# EAGLE design USBHopper (EAGLE 6.5.0)
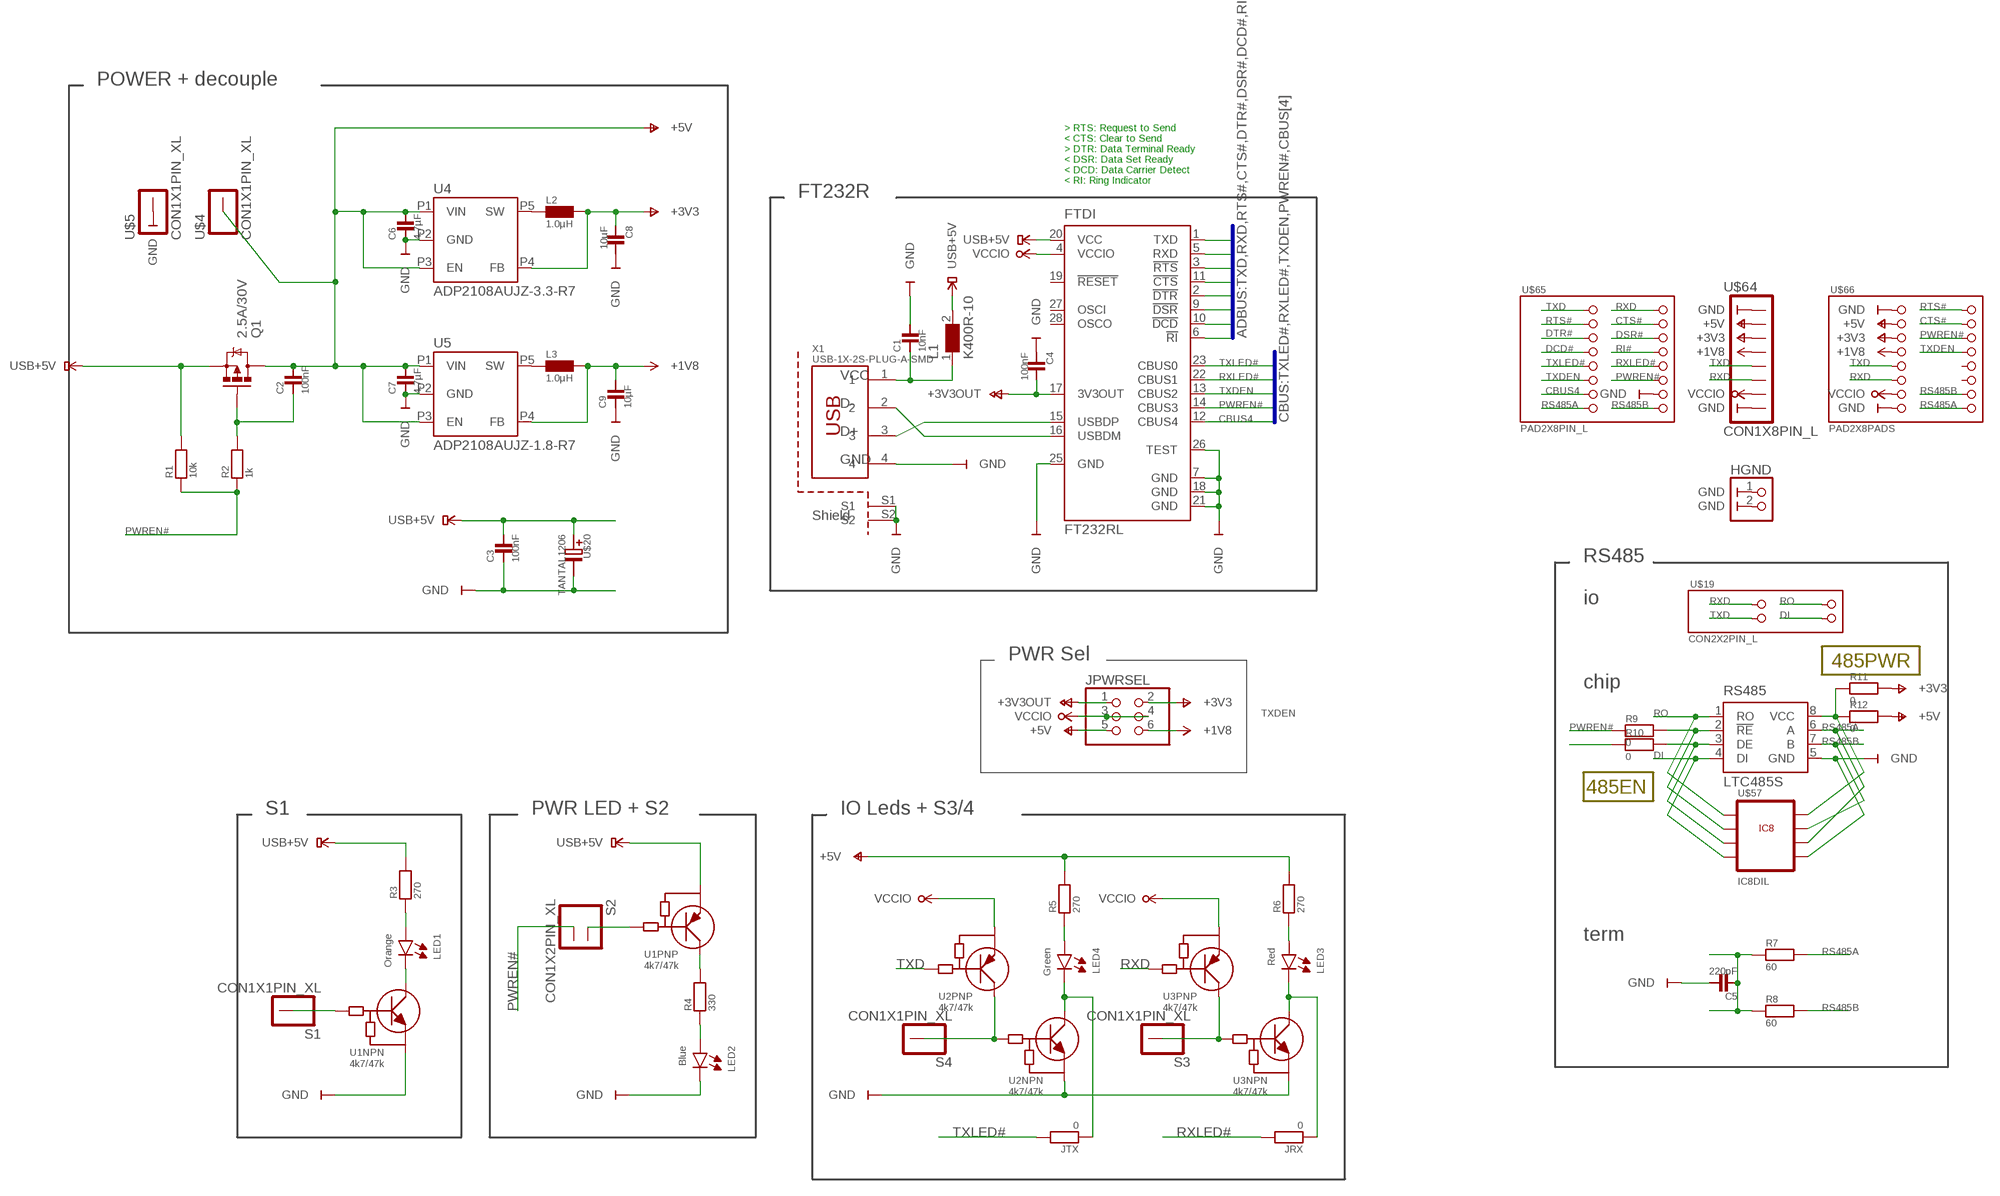
[diagram p0: schematic, sheet 1]

## Parts
C1  10nF  CAPACITOR  [0805]
C2  100nF  CAPACITOR  [0805]
C3  100nF  CAPACITOR  [0805]
C4  100nF  CAPACITOR  [0805]
C5  220pF  CAPACITOR  [0805]
C6  4.7µF  CAPACITOR  [0805]
C7  4.7µF  CAPACITOR  [0805]
C8  10µF  CAPACITOR  [0805]
C9  10µF  CAPACITOR  [0805]
FTDI  FT232RL  [SSOP28_FLO]
HGND  PINHD-1X2  [1X02]
JPWRSEL  PINHD-2X3  [2X03]
JRX  0  RESISTORCONNECT  [0805_CONNECT]
JTX  0  RESISTORCONNECT  [0805_CONNECT]
L1  K400R-10  WE-CBF_0805  [0805]
L2  1.0µH  INDUCTOR  [0806]
L3  1.0µH  INDUCTOR  [0806]
LED1  Orange  LEDKPT-2012-E  [KPT-2012-E]
LED2  Blue  LEDKPT-2012-E  [KPT-2012-E]
LED3  Red  LEDKPT-2012-E  [KPT-2012-E]
LED4  Green  LEDKPT-2012-E  [KPT-2012-E]
Q1  2.5A/30V  MOSFET-PCHANNELDMG2307L  [SOT23-3]
R1  10k  RESISTORWIDE  [0805]
R2  1k  RESISTORWIDE  [0805]
R3  270  RESISTORWIDE  [0805]
R4  330  RESISTORWIDE  [0805]
R5  270  RESISTORWIDE  [0805]
R6  270  RESISTORWIDE  [0805]
R7  60  RESISTORWIDE  [0805]
R8  60  RESISTORCONNECT  [0805_CONNECT]
R9  0  RESISTORCONNECT  [0805_CONNECT]
R10  0  RESISTORCONNECT  [0805_CONNECT]
R11  0  RESISTORCONNECT  [0805_CONNECT]
R12  0  RESISTORCONNECT  [0805_CONNECT]
RS485  LTC485S  [SOIC8]
S1  CON1X1PIN_XL  [1X1PINS]
S2  CON1X2PIN_XL  [1X2PINS]
S3  CON1X1PIN_XL  [1X1PINS]
S4  CON1X1PIN_XL  [1X1PINS]
U1  4k7/47k  PNP_NPN_BIASNXP_PIMD3  [SOT-457]
U2  4k7/47k  PNP_NPN_BIASNXP_PIMD3  [SOT-457]
U3  4k7/47k  PNP_NPN_BIASNXP_PIMD3  [SOT-457]
U4  ADP2108AUJZ-3.3-R7  DCDC  [SOT23]
U5  ADP2108AUJZ-1.8-R7  DCDC  [SOT23]
U$4  CON1X1PIN_XL  [1X1PINS]
U$5  CON1X1PIN_XL  [1X1PINS]
U$19  CON2X2PIN_L  [2X2PINS_L]
U$20  TANTAL1206  [1206]
U$57  IC8DIL  [DIL8]
U$64  CON1X8PIN_L  [1X8PINS_L]
U$65  PAD2X8PIN_L  [2X8PINS_L]
U$66  PAD2X8PADS  [2X8PADS]
X1  USB-1X-2S-PLUG-A-SMD  [USB-PLUG-A-SMD-2S]

## Nets
+1V8: C9.P$2 JPWRSEL.6 L3.P$1 U5.P4(FB) U$64.P$4 U$66.P$7
+3V3: C8.P$1 JPWRSEL.2 L2.P$1 R11.P$2 U4.P4(FB) U$64.P$3 U$66.P$5
+3V3OUT: C4.P$2 FTDI.17(3V3OUT) JPWRSEL.1
+5V: C2.P$2 C6.P$2 C7.P$2 JPWRSEL.5 Q1.3(D) R5.P$2 R6.P$2 R12.P$2 U4.P1(VIN) U4.P3(EN) U5.P1(VIN) U5.P3(EN) U$4.P$1 U$64.P$2 U$66.P$3
CBUS4: FTDI.12(CBUS4) U$65.P$13
CTS#: FTDI.11(!CTS) U$65.P$4 U$66.P$4
DCD#: FTDI.10(!DCD) U$65.P$7
DE: R10.P$2 RS485.3(DE) U$57.P$3
DI: RS485.4(DI) U$19.P$4 U$57.P$4
DSR#: FTDI.9(!DSR) U$65.P$6
DTR#: FTDI.2(!DTR) U$65.P$5
GND: C1.P$2 C3.P$1 C4.P$1 C5.P$2 C6.P$1 C7.P$1 C8.P$2 C9.P$1 FTDI.7(GND) FTDI.18(GND) FTDI.21(GND) FTDI.25(GND) FTDI.26(TEST) HGND.1 HGND.2 LED2.2(C$1) RS485.5(GND) U1.P$1(NPN:E) U2.P$1(NPN:E) U3.P$1(NPN:E) U4.P2(GND) U5.P2(GND) U$5.P$1 U$20.P$2 U$57.P$5 U$64.P$1 U$64.P$8 U$65.P$14 U$66.P$1 U$66.P$15 X1.4 X1.S1 X1.S2
N$1: LED2.1(A$1) R4.P$1
N$2: LED1.1(A$1) R3.P$1
N$4: C1.P$1 L1.1 X1.1
N$5: L2.P$2 U4.P5(SW)
N$6: JRX.P$1 LED3.2(C$1) U3.P$6(NPN:C)
N$7: L3.P$2 U5.P5(SW)
N$8: C5.P$1 R7.P$1 R8.P$1
N$9: R11.P$1 R12.P$1 RS485.8(VCC) U$57.P$8
N$10: JTX.P$1 LED4.2(C$1) U2.P$6(NPN:C)
N$11: LED4.1(A$1) R5.P$1
N$12: LED3.1(A$1) R6.P$1
N$13: R4.P$2 U1.P$3(PNP:C)
N$14: S2.P$1 U1.P$5(PNP:B)
N$15: LED1.2(C$1) U1.P$6(NPN:C)
PWREN: C2.P$1 Q1.1(G) R2.P$2
PWREN#: FTDI.14(CBUS3) R1.P$1 R2.P$1 R9.P$1 S2.P$2 U$65.P$12 U$66.P$6
RE#: R9.P$2 RS485.2(!RE) U$57.P$2
RI#: FTDI.6(!RI) U$65.P$8
RO: RS485.1(RO) U$19.P$2 U$57.P$1
RS485A: R7.P$2 RS485.6(A) U$57.P$6 U$65.P$15 U$66.P$16
RS485B: R8.P$2 RS485.7(B) U$57.P$7 U$65.P$16 U$66.P$14
RTS#: FTDI.3(!RTS) U$65.P$3 U$66.P$2
RXD: FTDI.5(RXD) U3.P$5(PNP:B) U$19.P$1 U$64.P$6 U$65.P$2 U$66.P$11
RXLED#: FTDI.22(CBUS1) JRX.P$2 U$65.P$10
SEN3: S4.P$1 U2.P$2(NPN:B) U2.P$3(PNP:C)
SEN4: S3.P$1 U3.P$2(NPN:B) U3.P$3(PNP:C)
SENSE: S1.P$1 U1.P$2(NPN:B)
TXD: FTDI.1(TXD) U2.P$5(PNP:B) U$19.P$3 U$64.P$5 U$65.P$1 U$66.P$9
TXDEN: FTDI.13(CBUS2) R10.P$1 U$65.P$11 U$66.P$8
TXLED#: FTDI.23(CBUS0) JTX.P$2 U$65.P$9
USB+5V: C3.P$2 FTDI.20(VCC) L1.2 Q1.2(S) R1.P$2 R3.P$2 U1.P$4(PNP:E) U$20.P$1
USBDM: FTDI.16(USBDM) X1.2
USBDP: FTDI.15(USBDP) X1.3
VCCIO: FTDI.4(VCCIO) JPWRSEL.3 JPWRSEL.4 U2.P$4(PNP:E) U3.P$4(PNP:E) U$64.P$7 U$66.P$13
Unconnected: FTDI.19(!RESET) FTDI.27(OSCI) FTDI.28(OSCO) U$66.P$10 U$66.P$12

## Buses
ADBUS:TXD,RXD,RTS#,CTS#,DTR#,DSR#,DCD#,RI#
CBUS:TXLED#,RXLED#,TXDEN,PWREN#,CBUS[4]

## Notes on the sheet
- POWER + decouple
- > RTS: Request to Send
  < CTS: Clear to Send
  > DTR: Data Terminal Ready
  < DSR: Data Set Ready
  < DCD: Data Carrier Detect
  < RI: Ring Indicator
- FT232R
- RS485
- io
- PWR Sel
- 485PWR
- chip
- 485EN
- S1 | PWR LED + S2 | IO Leds + S3/4
- term

## Library data of the parts
C1-C9 = flo-parts:CAPACITOR
FTDI = ftdichip:FT232R: Source: http://www.ftdichip.com/Documents/DataSheets/DS_FT232R_v104.pdf; MPN: FT232RL; OC_FARNELL: 1146032; OC_NEWARK: 91K9918
HGND = pinhead:PINHD-1X2: PIN HEADER
JPWRSEL = pinhead:PINHD-2X3: PIN HEADER
JRX JTX R1-R12 = flo-parts:RESISTOR
L1 = wuerth_elektronik:WE-CBF: SMD EMI Suppression Ferrite Beads WE-CBF - Excellent anti-EMI properties - Low DC-restistance - Impedances till 3000 ohms - Rated current up to 6 A -- Reliable Ni-Sn electrodes -- Perfect as data lined filter and for uncoupling of distribution voltage
L2 L3 = flo-parts:INDUCTOR
LED1-LED4 = flo-led:LED
Q1 = SparkFun-DiscreteSemi:MOSFET-PCHANNEL: Generic PMOSFET IRLML2244 - TRANS-11153 (SOT-23 -20V -4.3A) (1.Gate 2.Source 3.Drain) FQP27P06 - COM-10349 <http://www.sparkfun.com/products/10349> (TO-220 -60V -27A) (1.Gate 2.Source 3.Drain); PROD_ID: TRANS-11308
RS485 = linear-technology:LTC485: Low Power RS485 Interface Transceiver Source: http://www.linear.com/pc/downloadDocument.do?navId=H0,C1,C1007,C1017,P2064,D1718; OC_FARNELL: unknown; OC_NEWARK: unknown
S1 S3 S4 U$4 U$5 = flo-header:CON1X1
S2 = flo-header:CON1X2
U1-U3 = flo-logic:PNP_NPN_BIAS
U4 U5 = flo-parts:DCDC: e.g. MCP1603, ADP2108
U$19 = flo-header:CON2X2
U$20 = flo-parts:TANTAL
U$57 = flo-gen-ic:IC8
U$64 = flo-header:CON1X8
U$65 U$66 = flo-header:PAD2X8
X1 = con-usb:USB-1X-2S

## Board
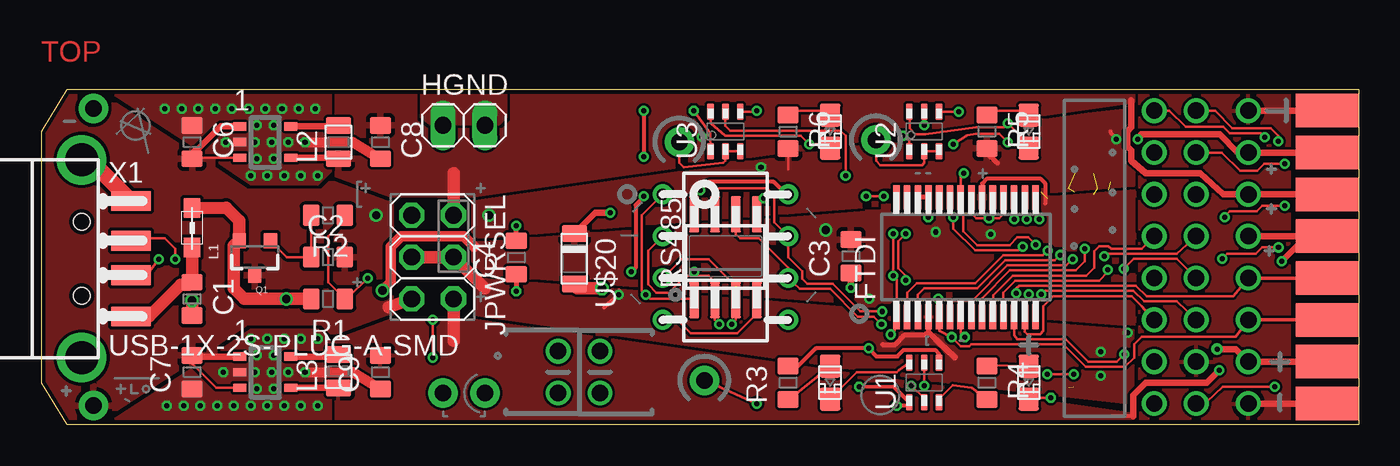
[diagram p1: board, top side]
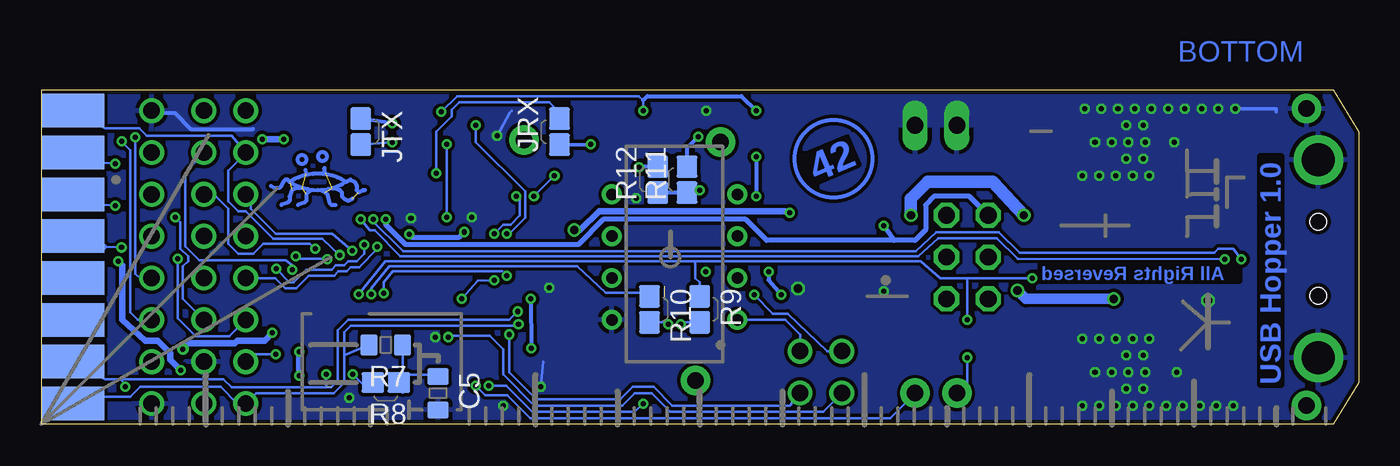
[diagram p2: board, bottom side, seen from below]

Size 80 x 20.32 mm. Coordinates in mm from the lower left corner, seen from the top.
Outline: 1.54,0 80,0 80,20.32 1.54,20.32 0,17.78 0,2.54 1.54,0
Copper layers (1*16): Top 0.035mm / dielectric 1.5mm / Bottom 0.035mm
Design rules "ITEADstudio_DRC": minimum track width 6mil, minimum drill 12mil, track to track 6mil, track to pad 6mil, pad to pad 6mil, via to via 6mil, smd to smd 0mil, copper to edge 10mil, drill to drill 10mil, minimum pad ring 10mil, minimum via ring 6mil, stop-mask expansion 2mil, vias tented up to drill 100mil, thermal gap 10mil

### Footprints (pad centres in the part's own frame; a part is rotated, then mirrored left to right if it is on the bottom)
0805 = smd 1.016 x 1.27: P$1 -1.016,0; P$2 1.016,0
SSOP28_FLO = smd 0.4 x 1.5: 1 -4.225,-3.625; 2 -3.575,-3.625; 3 -2.925,-3.625; 4 -2.275,-3.625; 5 -1.625,-3.625; 6 -0.975,-3.625; 7 -0.325,-3.625; 8 0.325,-3.625; 9 0.975,-3.625; 10 1.625,-3.625; 11 2.275,-3.625; 12 2.925,-3.625; 13 3.575,-3.625; 14 4.225,-3.625; 15 4.225,3.625; 16 3.575,3.625; 17 2.925,3.625; 18 2.275,3.625; 19 1.625,3.625; 20 0.975,3.625; 21 0.325,3.625; 22 -0.325,3.625; 23 -0.975,3.625; 24 -1.625,3.625; 25 -2.275,3.625; 26 -2.925,3.625; 27 -3.575,3.625; 28 -4.225,3.625
1X02 = drill 1.016 long: 1 -1.27,0; 2 1.27,0
2X03 = drill 1.016 octagon: 1 -2.54,-1.27; 2 -2.54,1.27; 3 0,-1.27; 4 0,1.27; 5 2.54,-1.27; 6 2.54,1.27
0805_CONNECT = smd 1.372 x 1.27: P$1 -0.787,0; P$2 0.787,0
0805' = smd 1.2 x 1: 1 -1.2,0; 2 1.2,0
0806 = smd 1.016 x 1.524: P$1 -1.016,0; P$2 1.016,0
KPT-2012-E = smd 1.25 x 1.4: 1 0,-1; 2 0,1
SOT23-3 = smd 0.8 x 0.9: 1 -0.95,-1; 2 0.95,-1; 3 0,1.1
SOIC8 = smd 0.6 x 2.2: 1 -1.905,-2.6; 2 -0.635,-2.6; 3 0.635,-2.6; 4 1.905,-2.6; 5 1.905,2.6; 6 0.635,2.6; 7 -0.635,2.6; 8 -1.905,2.6
1X1PINS = drill 1 pad 1.778: P$1 0,0
1X2PINS = drill 1 pad 1.778: P$1 0,1.27; P$2 0,-1.27
SOT-457 = smd 1 x 0.4: P$1 -1.2,0.9; P$2 -1.2,0; P$3 -1.2,-0.9; P$4 1.2,-0.9; P$5 1.2,0; P$6 1.2,0.9
SOT23 = smd 0.5 x 0.8: P1 -0.95,-1.55; P2 0,-1.55; P3 0.95,-1.55; P4 0.95,1.55; P5 -0.95,1.55
2X2PINS_L = drill 1: P$1 -1.27,1.27; P$2 1.27,1.27; P$3 -1.27,-1.27; P$4 1.27,-1.27
1206 = smd 1.016 x 1.524: P$1 -1.524,0; P$2 1.524,0
DIL8 = drill 0.7: P$1 -3.81,3.81; P$2 -3.81,1.27; P$3 -3.81,-1.27; P$4 -3.81,-3.81; P$5 3.81,-3.81; P$6 3.81,-1.27; P$7 3.81,1.27; P$8 3.81,3.81
1X8PINS_L = drill 1: P$1 0,8.89; P$2 0,6.35; P$3 0,3.81; P$4 0,1.27; P$5 0,-1.27; P$6 0,-3.81; P$7 0,-6.35; P$8 0,-8.89
2X8PINS_L = drill 1: P$1 -1.27,8.89; P$2 1.27,8.89; P$3 -1.27,6.35; P$4 1.27,6.35; P$5 -1.27,3.81; P$6 1.27,3.81; P$7 -1.27,1.27; P$8 1.27,1.27; P$9 -1.27,-1.27; P$10 1.27,-1.27; P$11 -1.27,-3.81; P$12 1.27,-3.81; P$13 -1.27,-6.35; P$14 1.27,-6.35; P$15 -1.27,-8.89; P$16 1.27,-8.89
2X8PADS = smd 3.81 x 2.032: P$1 -1.905,8.89; P$3 -1.905,6.35; P$5 -1.905,3.81; P$7 -1.905,1.27; P$9 -1.905,-1.27; P$11 -1.905,-3.81; P$13 -1.905,-6.35; P$15 -1.905,-8.89 | smd 3.81 x 2.032 bottom: P$2 -1.905,8.89; P$4 -1.905,6.35; P$6 -1.905,3.81; P$8 -1.905,1.27; P$10 -1.905,-1.27; P$12 -1.905,-3.81; P$14 -1.905,-6.35; P$16 -1.905,-8.89
USB-PLUG-A-SMD-2S = smd 2.4 x 1.2: 1 10.9,-3.6; 2 10.9,-1.1; 3 10.9,1; 4 10.9,3.4 | drill 2: S1 7.9,-6.1; S2 7.9,5.9 | hole 1: 7.9,-2.35; 7.9,2.15

### Placement (x,y rotation side)
C1  9.16,7.62 270 top
C2  17.41,10.16 0 top
C3  49.16,10.21 90 top
C4  28.84,10.13 90 top
C5  55.9,1.91 270 bottom
C6  9.16,17.14 270 top
C7  9.16,3.17 90 top
C8  20.59,17.14 270 top
C9  20.59,3.17 90 top
FTDI  56.15,10.16 0 top
HGND  25.67,18.16 0 top
JPWRSEL  23.77,10.16 270 top
JRX  48.53,17.78 90 bottom
JTX  60.59,17.78 270 bottom
L1  K400R-10  [0805']  9.16,11.94 90 top
L2  18.05,17.14 90 top
L3  18.05,3.23 90 top
LED1  47.9,2.54 180 top
LED2  59.96,2.54 180 top
LED3  47.9,17.78 180 top
LED4  59.96,17.78 180 top
Q1  12.97,10.16 180 top
R1  17.41,7.62 180 top
R2  17.41,12.7 180 top
R3  45.35,2.54 90 top
R4  57.42,2.54 270 top
R5  57.42,17.78 270 top
R6  45.35,17.78 270 top
R7  59.07,4.83 180 bottom
R8  59.07,2.54 180 bottom
R9  40.02,6.99 270 bottom
R10  43.07,6.99 270 bottom
R11  40.78,14.86 90 bottom
R12  42.56,14.86 90 bottom
RS485  41.55,10.16 0 top
S1  40.27,2.67 0 top
S2  25.67,1.91 270 top
S3  38.75,17.14 0 top
S4  50.69,17.27 0 top
U1  53.61,2.54 90 top
U2  53.61,17.78 90 top
U3  41.55,17.78 90 top
U4  13.61,17.14 270 top
U5  13.61,3.17 270 top
U$4  3.17,1.14 0 top
U$5  3.17,19.18 0 top
U$19  32.66,3.17 90 top
U$20  32.38,10.06 270 top
U$57  41.55,10.16 0 top
U$64  73.3,10.16 0 top
U$65  68.85,10.16 0 top
U$66  79.98,10.16 0 top
X1  -5.45,10.16 0 top

### Tracks (layer width: path | path; a pad name or v marks a point on that pad's centre or on a via)
+1V8  (via drill 0.3)
  Top 0.254: U$66.P$7 76.85,11.43 | 66.31,0.51 65.04,0.51
  Top 0.406: U$64.P$4 76.85,11.43 v75.33,9.91 | v71.52,3.3 70.75,2.54 67.07,2.54 66.31,1.78 66.31,0.51 | U5.P4 18.05,2.23 L3.P$1
  Top 0.762: JPWRSEL.6 25.04,5.08
  Bottom 0.406: v75.33,9.91 75.07,9.65 75.07,6.35 73.68,5.08 72.91,5.08 72.15,4.32 72.15,3.94 v71.52,3.3
  pour Top (rank 2): 21.23,6.35 4.08,0 66.15,0 66.31,0.16 66.31,0.64 26.3,6.35
+3V3  (via drill 0.3)
  Top 0.152: v40.1,17.48 40.02,17.91 39.89,18.03
  Top 0.406: U$66.P$5 U$64.P$3 71.77,13.97 70.37,15.24 67.07,15.24 66.18,16 66.18,16.64 65.93,16.89 65.93,17.78 66.18,18.03 66.18,19.68 | U4.P4 18.05,16.2 L2.P$1
  Top 0.762: JPWRSEL.2 25.04,15.24
  Bottom 0.254: R11.P$2 40.78,16.79 v40.1,17.48
  pour Top (rank 2): 4.08,20.32 21.23,13.97 26.3,13.97 66.31,19.68 66.33,20.32
+3V3OUT  (via drill 0.3)
  Top 0.305: C4.P$2 v28.84,12.06 | v59.07,12.45 v59.08,12.45 FTDI.17
  Bottom 0.305: JPWRSEL.1 23.64,13.84 25.8,13.84 26.3,13.34 26.3,11.81 26.94,11.18 28.21,11.18 | 28.21,11.18 35.96,11.18 37.23,12.45 45.86,12.45 47.39,10.92 57.88,10.92 59.07,12.12 v59.07,12.45 | v28.84,12.06 28.21,11.18
+5V  (via drill 0.3, 0.5)
  Top 0.152: U5.P3 10.62,2.23 9.16,3.68 C7.P$2 | U4.P3 9.23,16.2 | R6.P$2 45.35,15.49 | v43.7,15.62 43.83,15.62 43.96,15.75
  Top 0.254: v65.27,17.32 64.91,17.78
  Top 0.305: R5.P$2 57.42,16.51 58.05,15.88
  Top 0.406: U5.P1 9.23,4.12 C7.P$2 | 9.23,16.2 C6.P$2 | 9.38,16.58 10.9,18.09 U4.P1 | U$66.P$3 U$64.P$2 72.66,16.51 71.54,17.63 66.79,17.63 v66.59,17.32
  Top 0.508: 9.23,16.2 9.38,16.58
  Top 0.762: JPWRSEL.5 21.1,7.11
  Bottom 0.254: R12.P$2 43.68,15.65 v43.7,15.62
  Bottom 0.406: v66.59,17.32 v65.27,17.32
  Bottom 0.762: v20.34,12.7 22.24,14.73 26.18,14.73 27.19,13.72 v27.19,12.7
  pour Top (isolate 0.203, rank 4): 0.36,22.23 21.23,13.72 21.23,6.73 0.36,-2.54
  pour Top (rank 3): 26.3,14.61 66.3,19.05 66.3,14.61 26.3,11.43
CBUS4  (via drill 0.3)
  Top 0.152: FTDI.12 59.08,5.41 59.27,5.18 62.2,5.18 63.57,3.81 65.29,3.81 v65.75,4.27
  Bottom 0.152: U$65.P$13 67.12,4.27 v65.75,4.27
CTS#  (via drill 0.3)
  Top 0.152: v75.5,15.82 74.26,15.82 73.83,15.39 72.79,15.39 71.67,16.51 U$65.P$4 | FTDI.11 58.42,7.99 59.15,8.74 64.23,8.74 64.76,9.27 v64.76,9.4
  Bottom 0.152: U$66.P$4 76.22,15.88 v75.5,15.82 | v64.76,9.4 64.76,9.65 65.14,9.98 70.4,9.98 71.24,10.82 71.24,15.24 U$65.P$4
DCD#
  Top 0.152: U$65.P$7 66.82,10.67 64.96,10.67 64.79,10.82 64.23,10.82 63.92,10.52 63.92,9.53 63.44,9.04 58.99,9.04 57.8,7.85 FTDI.10
DE  (via drill 0.3)  (1 unrouted)
  Top 0.152: 42.18,8.38 40.53,10.03 38.88,10.03 U$57.P$3 | RS485.3 42.18,6.35 v41.93,6.1
  Bottom 0.152: R10.P$2 42.03,6.2 v41.93,6.1
DI
  Top 0.152: RS485.4 43.45,6.73 42.26,5.54 39.44,5.54 38.62,6.35 U$57.P$4
  Bottom 0.152: U$57.P$4 34.81,6.35 33.92,5.46 U$19.P$4
DSR#  (via drill 0.3)
  Top 0.152: FTDI.9 57.12,7.66 58.82,9.35 62.8,9.35 63.36,9.91 v63.36,10.67
  Bottom 0.152: U$65.P$6 69.56,14.02 68.65,13.11 68.65,10.97 68.04,10.36 67.12,10.36 66.51,10.97 63.69,10.97 v63.36,10.67
DTR#  (via drill 0.3)
  Top 0.152: FTDI.2 52.58,7.98 53.15,8.56 56.71,8.56 58.41,10.26 60.82,10.26 v61.1,10.54
  Bottom 0.152: U$65.P$5 67.28,13.66 67.28,13.11 65.75,11.58 62.32,11.58 v61.1,10.54
FSM  (6 unrouted)
  Bottom 0.254: 61.48,14.73 arc-65 64.91,14.73 | 64.91,14.73 arc-65 61.48,14.73 | 64.91,14.73 65.04,14.86 65.17,14.86 65.29,14.73 65.42,14.48 65.55,14.35 65.8,14.35 66.06,14.48 | 61.48,14.73 61.23,14.86 60.98,14.73 60.85,14.48 60.85,14.22 60.72,14.1 60.47,14.22 60.34,14.22 | 64.15,14.35 64.53,14.35 64.79,14.22 64.91,13.84 64.91,13.59 65.04,13.46 65.42,13.34 | 63.64,14.22 63.9,13.97 63.9,13.59 64.02,13.46 64.41,13.34 | 63.01,14.22 62.75,14.1 62.63,13.97 62.5,13.46 62.37,13.34 62.12,13.34 | 62.37,14.35 62.12,14.35 61.87,14.22 61.74,14.1 61.74,13.84 61.61,13.72 61.36,13.59 61.1,13.72 | 62.75,15.24 62.8,15.57 | 63.9,15.24 63.95,15.44 | 64.91,14.73 64.79,14.81
GND  (via drill 0.3, 0.5)
  Top 0.152: v53.86,12.57 53.88,12.46 | 55.9,6.46 FTDI.7 55.83,5.53 v56.07,5.31 | FTDI.18 58.42,12.77 58.18,12.52 v57.55,12.52 56.78,12.52 56.48,12.83 FTDI.21 | LED2.2 59.98,1.61 v61.31,1.63 | U2.P$1 52.71,17.3 v52.32,17.53 | U3.P$1 40.63,17.68 v39.62,19.05
  Top 0.254: v49.66,2.29 51.8,2.27 U1.P$1 52.71,1.14 v51.94,1.14
  Top 0.305: C4.P$1 v28.84,8.08 | 53.88,12.46 FTDI.25 FTDI.26
  Top 0.406: RS485.5 43.45,13.46 v43.88,13.74 | U$64.P$1 U$66.P$1 | U$66.P$15 U$64.P$8 | v49.16,8.31 C3.P$1
  Top 0.61: v16.02,17.14 18.94,17.14 C8.P$2 | v16.02,3.17 18.94,3.17 C9.P$1
  Top 0.762: v9.16,7.52 C1.P$2 | v34.05,8.26 32.55,8.26 32.55,8.36 U$20.P$2
  Top 1.016: X1.4 2.96,16.06 X1.S2
  Bottom 0.152: v52.32,17.53 51.56,18.92 51.44,19.05 | v49.66,2.29 49.53,3.81
  Bottom 0.203: v7.51,19.18 5,19.18 5,19
  Bottom 0.254: U$64.P$1 73.17,18.92 71.9,18.92 70.91,17.93 67.15,17.93
  other vias: 13.99,17.14 14.11,16.13 15,17.14 14.11,18.16 10.56,19.18 13.61,19.18 14.62,19.18 9.54,19.18 8.53,19.18 13.73,15.11 14.75,15.11 13.99,3.17 15,3.17 14.11,4.19 14.11,2.16 13.73,5.21 14.75,5.21 13.73,1.14 14.75,1.14 11.06,3.17 10.68,1.14 9.67,1.14 8.65,1.14 7.64,1.14 15.76,5.21 15.76,15.11 15.64,19.18 15.76,1.14 11.57,19.18 12.59,19.18 11.7,1.14 12.72,1.14 12.97,3.17 12.97,17.14 11.22,17.14 12.72,5.21 12.72,15.11 13.1,16.13 13.1,18.16 13.1,4.19 13.1,2.16 16.78,5.21 16.78,1.14 16.65,19.18 16.78,15.11
  pour Top (no thermals): 4.08,20.32 17.54,20.32 17.54,15.37 16.78,14.61 12.72,14.61 9.54,16.76
  pour Top (no thermals): 4.08,0 17.54,0 17.54,4.95 16.78,5.71 12.72,5.71 9.54,3.56
  pour Top: 66.67,20.27 75.81,20.27 75.81,0 66.67,0
  pour Bottom (isolate 0.203, rank 6): 1.54,20.32 80,20.32 80,0 1.54,0 0,2.54 0,17.78
  pour Top (no thermals): 23.11,20.45 23.11,18.67 23.62,18.29 27.81,18.29 28.19,18.67 28.19,20.45
  pour Bottom (no thermals): 23.11,20.45 23.11,18.67 23.37,18.29 27.56,18.29 28.19,18.67 28.19,20.45
N$1
  Top 0.152: LED2.1 57.45,3.59 R4.P$1
N$2
  Top 0.152: LED1.1 45.39,1.49 R3.P$1
N$4
  Top 0.762: X1.1 6.58,6.56 8.49,8.47 8.99,8.47 C1.P$1 L1.1
N$5
  Top 0.406: U4.P5 18.05,18.09 L2.P$2
N$6  (via drill 0.3)
  Top 0.152: LED3.2 47.61,17.02 v46.62,17.02 46.12,17.53 41.55,17.53 40.64,18.29 U3.P$6
  Bottom 0.254: JRX.P$1 v46.62,17.02
N$7
  Top 0.406: U5.P5 18.05,4.12 L3.P$2
N$8
  Bottom 0.152: R7.P$1 58.05,3.02 | 58.05,3.02 58.05,1.93 R8.P$1 | C5.P$1 55.64,3.02 58.05,3.02
N$9  (via drill 0.3)
  Top 0.254: U$57.P$8 45.23,13.97 44.47,14.73 40.53,14.73 v40.02,14.22 39.64,13.84 RS485.8
  Bottom 0.254: v40.02,14.22 40.76,14.33 R11.P$1 R12.P$1
N$10  (via drill 0.3)
  Top 0.152: LED4.2 59.96,17.02 v58.69,18.29 58.44,18.03 56.78,18.03 53.66,17.63 53.06,17.63 52.73,17.98 U2.P$6
  Bottom 0.254: v58.69,18.29 JTX.P$1
N$11
  Top 0.152: LED4.1 59.74,19.05 58.05,19.05 57.8,18.8 R5.P$1
N$12
  Top 0.152: LED3.1 47.67,19.05 45.99,19.05 45.74,18.8 R6.P$1
N$13
  Top 0.152: U1.P$3 54.51,1.53 55.34,2.39 56.51,2.23 R4.P$2
N$14  (via drill 0.3)
  Top 0.152: v53.61,2.34 U1.P$5
  Bottom 0.152: v53.61,2.34 53.05,1.78 51.69,1.78 50.31,0.38 28.46,0.38 S2.P$1
N$15
  Top 0.152: LED1.2 47.99,1.64 49.53,3.17 51.94,3.17 52.07,3.3 U1.P$6
PWREN
  Top 0.152: Q1.1 14.92,10.16 C2.P$1 R2.P$2
PWREN#  (via drill 0.3)
  Top 0.152: R2.P$1 18.43,12.45 17.41,11.43 17.41,8.64 R1.P$1 18.68,7.75 v19.83,8.89 | FTDI.14 60.38,7.38 v60.72,7.9 60.98,8.13 66.31,8.13 66.97,7.47 68.95,7.47 U$65.P$12 | v23.77,6.35 v23.77,4.06 | v75.5,13.28 74.13,13.28 73.8,12.95 72.15,12.95 71.85,12.65 v71.85,12.57
  Bottom 0.152: v19.83,8.89 23.77,8.89 | 40.4,9.91 26.58,9.91 25.42,8.89 23.77,8.89 | 40.4,9.91 59.1,9.91 v60.72,7.9 | 23.77,8.89 v23.77,6.35 | v23.77,4.06 23.77,2.54 S2.P$2 | U$66.P$6 76.22,13.34 v75.5,13.28 | v71.85,12.57 71.54,12.27 71.54,10.67 71.08,10.21 71.08,9.91 71.39,9.6 71.39,7.62 U$65.P$12 | R9.P$1 40.02,8.64 40.27,8.89 40.27,9.78 40.4,9.91
RE#  (via drill 0.3)
  Top 0.152: U$57.P$2 36.85,10.54 36.85,8.51 37.35,8 38.12,8 39.13,9.02 39.39,9.02 v39.64,9.27 39.89,9.02 40.53,9.02 40.91,8.64 RS485.2 40.91,6.35 v41.16,6.1
  Bottom 0.152: R9.P$2 41.06,6.2 v41.16,6.1
RI#  (via drill 0.3)
  Top 0.152: U$65.P$8 68.95,10.36 64.76,10.36 v64.53,10.21 | FTDI.6 55.17,7.28 55.41,7.52 56.53,7.52 58.66,9.65 62.25,9.65 v62.63,10.03
  Bottom 0.152: v64.53,10.21 64.28,10.06 62.63,10.06 v62.63,10.03
RO  (via drill 0.3)
  Top 0.152: RS485.1 39.58,7.62 36.97,7.62 v36.72,7.87 36.47,8.13 36.47,12.7 U$57.P$1
  Bottom 0.152: v36.72,7.87 35.58,6.73 34.69,6.73 32.27,4.45 U$19.P$2
RS485A  (via drill 0.3)
  Top 0.152: RS485.6 42.18,11.56 42.43,11.3 43.58,11.3 45.35,9.53 U$57.P$6 46.07,8.23 47.9,8.23 49.57,6.55 50.56,6.55 v51.02,6.1
  Bottom 0.152: U$66.P$16 77.79,1.37 77.49,1.68 74.59,1.68 73.98,2.29 69.1,2.29 68.09,1.27 U$65.P$15 66.94,1.91 62.25,1.91 61.61,2.54 61.61,4.19 | v51.02,6.1 51.17,5.99 61.2,5.99 61.61,5.59 61.61,4.19 | R7.P$2 61.61,4.19
RS485B  (via drill 0.3)  (1 unrouted)
  Top 0.152: RS485.7 40.91,14.1 41.16,14.35 44.09,14.35 44.52,13.92 44.52,12.27 U$57.P$7 45.35,10.16 46.22,9.3 46.22,8.84 46.52,8.53 48.05,8.53 49.72,6.86 v51.07,6.86 | v74.89,2.29 71.75,2.29 70.78,1.37 70.68,1.27 U$65.P$16 | v62.7,3.05 v61.08,3.05
  Bottom 0.152: U$66.P$14 76.11,2.74 75.2,2.74 | 75.2,2.74 68.95,2.74 68.44,2.26 62.4,2.26 61.99,2.67 61.99,5.71 61.36,6.35 51.58,6.35 v51.07,6.86 | v74.89,2.29 74.89,2.44 75.2,2.74 | 62.7,2.29 v62.7,3.05 | R8.P$2 60.11,2.08 v61.08,3.05
RTS#  (via drill 0.3)
  Top 0.152: FTDI.3 53.23,7.87 53.61,8.26 56.84,8.26 58.54,9.96 61.53,9.96 v61.87,10.29
  Bottom 0.152: U$66.P$2 76.11,17.98 74.06,17.98 73.6,17.53 68.44,17.53 U$65.P$3 68.65,15.39 68.65,13.56 68.04,12.95 67.58,12.95 65.9,11.28 62.93,11.28 v61.87,10.29
RXD  (via drill 0.3)
  Top 0.152: 54.5,6.54 FTDI.5 54.52,5.94 | U$64.P$6 72.53,5.33 66.82,5.33 66.36,4.88 66.36,4.06 65.8,3.5 63.41,3.5 62.04,4.88 56.48,4.88 56.35,4.75 55.84,4.75 v55.29,5.31 54.52,5.69 54.52,5.94 | U$65.P$2 71.29,19.05 72.3,17.98 74.64,17.98 75.1,17.53 v75.1,17.2 | U3.P$5 41.52,18.95 41.52,18.14 41.82,17.83 48.53,17.83 48.84,17.53 v48.84,15.09 | v50.08,13.84 v51.15,13.84 | v52.49,11.58 52.03,11.12 52.03,9.47 52.49,9.02 v52.49,8.76 | v54.47,7.62 54.47,6 54.52,5.94
  Top 0.203: U$64.P$6 U$66.P$11
  Bottom 0.152: U$19.P$1 32.53,0.76 41.8,0.76 42.94,1.91 43.96,1.91 44.72,1.14 50.05,1.14 51.96,3.05 51.96,4.57 52.77,5.38 55.21,5.38 v55.29,5.31 | v75.1,17.2 75.1,17.17 74.59,16.66 74.59,6.81 74.13,6.35 U$64.P$6 | v48.84,15.09 v50.08,13.84 | v51.15,13.84 50.94,13.64 50.94,12.7 51.5,12.12 51.96,12.12 v52.49,11.58 | v52.49,8.76 53.51,8.74 v54.47,7.62
RXLED#  (via drill 0.3)
  Top 0.152: v56.02,15.24 55.83,15.06 FTDI.22 55.83,12.9 55.97,12.75 55.97,11.73 56.84,10.87 58.79,10.87 59.27,11.35 59.94,11.35 v60.39,10.9 | U$65.P$10 68.95,10.06 66.33,10.06 v65.73,9.45
  Bottom 0.152: v56.02,15.24 56.02,17.78 55.08,18.72 55.08,19.1 54.63,19.56 49.16,19.56 48.53,18.92 JRX.P$2 | v60.39,10.9 60.39,10.36 60.85,9.91 61.36,9.91 61.61,9.65 62.12,9.65 62.37,9.4 63.9,9.4 64.66,8.64 64.94,8.64 v65.73,9.45
SEN3
  Top 0.152: U2.P$3 U2.P$2 53.61,15.88 53.48,15.75 50.94,15.75 50.69,16 S4.P$1
SEN4
  Top 0.152: U3.P$3 U3.P$2 41.55,16 41.42,15.88 39.01,15.62 38.75,15.88 S3.P$1
SENSE  (via drill 0.3)
  Top 0.152: v52.82,2.34 53.61,1.6 U1.P$2 | v43.45,1.27 S1.P$1
  Bottom 0.152: v52.82,2.34 51.76,2.34 50.18,0.76 43.96,0.76 v43.45,1.27
TXD  (via drill 0.3)
  Top 0.152: v51.58,5.46 51.83,5.71 51.96,6.5 | 51.96,6.5 FTDI.1 | U$64.P$5 72.38,7.77 67.12,7.77 66.46,8.43 59.38,8.43 59.2,8.26 v59.2,7.98 | 51.96,6.5 51.96,8.79 v51.73,9.02 v51.73,11.58 | U$65.P$1 68.49,19.05 69.48,18.06 71.77,18.06 72.15,17.68 74.03,17.68 v74.29,17.42 | v53.61,18.16 U2.P$5
  Top 0.203: U$64.P$5 U$66.P$9
  Bottom 0.152: U$19.P$3 34.56,1.14 41.67,1.14 42.81,2.29 44.09,2.29 44.85,1.52 49.93,1.52 51.58,3.17 v51.58,5.46 | v51.73,9.02 52.01,9.3 58.66,9.3 59.2,8.64 v59.2,7.98 | v74.29,17.42 74.29,9.14 73.98,8.89 U$64.P$5 | v51.73,11.58 51.58,11.58 50.61,12.55 50.61,14.15 53.61,17.14 v53.61,18.16
TXDEN  (via drill 0.3)
  Top 0.152: v59.96,7.9 59.73,7.55 FTDI.13 59.73,5.64 59.88,5.49 60.65,5.49 60.85,5.69 60.85,7.16 61.46,7.77 66.21,7.77 66.82,7.16 67.5,6.35 U$65.P$11 | v75.12,10.74 74.13,10.74 73.75,10.36 72,10.36 v71.69,10.06
  Bottom 0.152: v59.96,7.9 59.96,8.28 58.87,9.6 47.44,9.6 45.74,8 43.3,8 R10.P$1 | 76.22,10.79 v75.12,10.74 | v71.69,10.06 71.69,6.45 70.6,5.36 68.57,5.36 U$65.P$11
  Bottom 0.406: U$66.P$8 76.22,10.79
TXLED#  (via drill 0.3)
  Top 0.152: v58.69,17.14 58.18,17.65 56.78,17.65 56.23,17.55 v55.39,17.02 | FTDI.23 55.17,14.44 55.13,12.83 v55.39,12.57 55.39,11.89 56.71,10.57 59.33,10.57 v59.6,10.79
  Bottom 0.152: 58.84,17.14 JTX.P$2 v58.69,17.14 | v55.39,17.02 v55.39,12.57 | U$65.P$9 65.78,8.89 65.17,8.28 64.51,8.28 63.74,9.04 62.22,9.04 61.97,9.3 61.46,9.3 61.2,9.55 60.7,9.55 59.55,10.69 v59.6,10.79
USB+5V  (via drill 0.3, 0.5)
  Top 0.152: 45.97,3.56 R3.P$2
  Top 0.254: 45.97,3.56 47.03,4.62 v50.26,4.62 50.71,4.14 51.98,4.14 52.37,4.52 54.27,4.52 54.51,4.28 U1.P$4 | 60.95,13.41 60.95,14.63 60.65,14.94 57.45,14.94 57.12,14.62 FTDI.20
  Top 0.406: v34.56,12.85 33.65,12.85 U$20.P$1
  Top 0.635: 26.3,10.79 25.67,11.43 21.86,11.43 21.23,10.79 21.23,8.64 v20.72,8.13
  Top 0.762: L1.2 11.23,13.16 12.02,12.38 Q1.2 11.7,10.84 11.7,8.26 12.34,7.62 v14.88,7.62 R1.P$2
  Bottom 0.254: v50.28,7.62 v50.26,4.62
  Bottom 0.305: v57.65,11.56 57.52,11.38 54.63,11.38 v54.32,11.68
  Bottom 0.406: v34.56,12.85 34.81,12.95 46.12,12.95 47.26,11.81 v47.64,11.81
  Bottom 0.635: v14.88,7.62 20.21,7.62 v20.72,8.13
  pour Top (rank 4): 26.3,11.43 26.3,8.26 66.3,5.71 66.3,14.61
USBDM  (via drill 0.3)
  Top 0.152: v7.13,10.03 6.37,9.02 | v59.83,12.45 59.73,12.54 FTDI.16
  Top 0.254: 6.37,9.02 X1.2
  Bottom 0.152: v7.13,10.03 7.64,10.67 8.53,10.67 8.78,10.41 20.59,10.41 21.86,11.68 25.67,11.68 26.89,10.52 58.03,10.52 59.94,12.39 59.78,12.39 v59.83,12.45
USBDP  (via drill 0.3)
  Top 0.152: v8.14,10.03 8.14,10.67 7.51,11.3 5.72,11.3 | v60.59,12.45 60.38,12.67 FTDI.15
  Top 0.254: 5.72,11.3 X1.3
  Bottom 0.152: v8.14,10.03 8.4,10.03 20.69,10.06 21.99,11.3 25.54,11.3 26.74,10.21 58.21,10.21 59.76,11.79 60.06,11.79 v60.59,12.45
VCCIO  (via drill 0.3, 0.3 pad 0.3, 0.3 pad 0.7)
  Top 0.152: U3.P$4 43.38,18.98 v43.45,19.05 | 54.81,18.98 U2.P$4 55.83,18.98 v55.72,18.97 | v65.98,5.56 66.03,5.56 65.93,5.59
  Top 0.254: v36.59,13.84 36.08,13.34 36.08,9.53 v35.83,9.27 | v36.59,19.05 v36.59,16.26 | 35.07,8.13 v35.07,7.87 34.18,7.11
  Top 0.305: 53.88,5.65 FTDI.4 | 51.09,4.85 51.86,4.85 52.44,5.44 53.66,5.44 53.88,5.65 | 53.88,5.65 53.88,5.6 54.37,5.11
  Top 0.406: U$66.P$13 U$64.P$7 72.53,4.57 v71.39,4.57 | 54.37,5.11 54.5,5 55.46,4.09
  Top 0.762: JPWRSEL.3 JPWRSEL.4 26.94,8.26
  Bottom 0.152: v55.72,18.97 54.75,19.94 43.7,19.94 43.45,19.68 v43.45,19.05
  Bottom 0.254: v36.59,19.05 37.48,19.94 43.2,19.94 43.45,19.68 | v36.59,16.26 v36.59,13.84 | v35.83,9.27 35.83,8.76 v35.07,7.87
  Bottom 0.406: v71.39,4.57 71.06,4.93 68.24,4.93 68.09,5.08 66.44,5.08 v65.98,5.56 | v64.33,4.42 v64.33,2.95
  pour Top (rank 3): 26.3,8.89 26.3,5.71 66.3,1.27 66.3,5.71
(copper drawn outside any net)
  shapes: Bottom circle x3

### Text on the board
Top: TOP
Bottom: BOTTOM | 42 | All Rights Reversed | USB Hopper 1.0
tStop: TSTOP
bStop: BSTOP | 2 | 4 | USB Hopper 1.0
Document: 3.3V | RS485 | 3.3 | 5.0 | 1.8 | 1.8V
tDocu: TSILK | =HOT= | 1 | www.binary-kitchen.de | PUNK | C6 | U4 | L2 | C8 | U3 | R6 | LED3 | U2 | R5 | LED4 | is not | 5 | GND | 3v3 | GND | S | 3 | S | 4 | 8 | 3 | 3 | 3 | 5 | 8 | 28 | 15 | V1.1 | DP | L1 | R2 | 2 | C4 | C5 | 485 | C3 | HOT / END | C2 | NOW YOU / SEE ME | DM | RO / RE / DE / DI | + / B / A / - | C1 | R1 | 5 | 2 | 4 | 4 | 5 | 14 | VCC | =HOT= | MOTHER BOARD | RO | DI | S | ENTER YOUR NAME HERE | C7 | U5 | L3 | C9 | BETA | S | 2 | binary | kitchen | R3 | LED1 | U1 | R4 | LED2 | TXD / RTS / DTR / DCD / CB0 / CB2 / CB4 / A | 1v8 | ? | Rx | Tx | 42 | RXD / CTS / DSR / RI / CB1 / CB3 / GND / B | Sen | S
bDocu: BSILK | U | RT | R=- | 485 | Pch | S | I | rxled | txled | CT | 60° | G | K | A | # | PE | 3 | 5 | D | 45° | TE | I t | B | C | C=--- | term | 30° | U | A | E | RE | DE | NPN | B | B | 7 | 6 | 5 | 4 | 3 | 1 | A